# Altium schematic sheet 18_AUDIO_PowerAmp-AnalogT.SchDoc: P30L
size A3; Organization: 六零加智能科技; Address4: www.nidone.com.cn; DocumentNumber: Kang jin; Revision: 1.0; SheetNumber: 16; SheetTotal: 23; Rule: 1.0
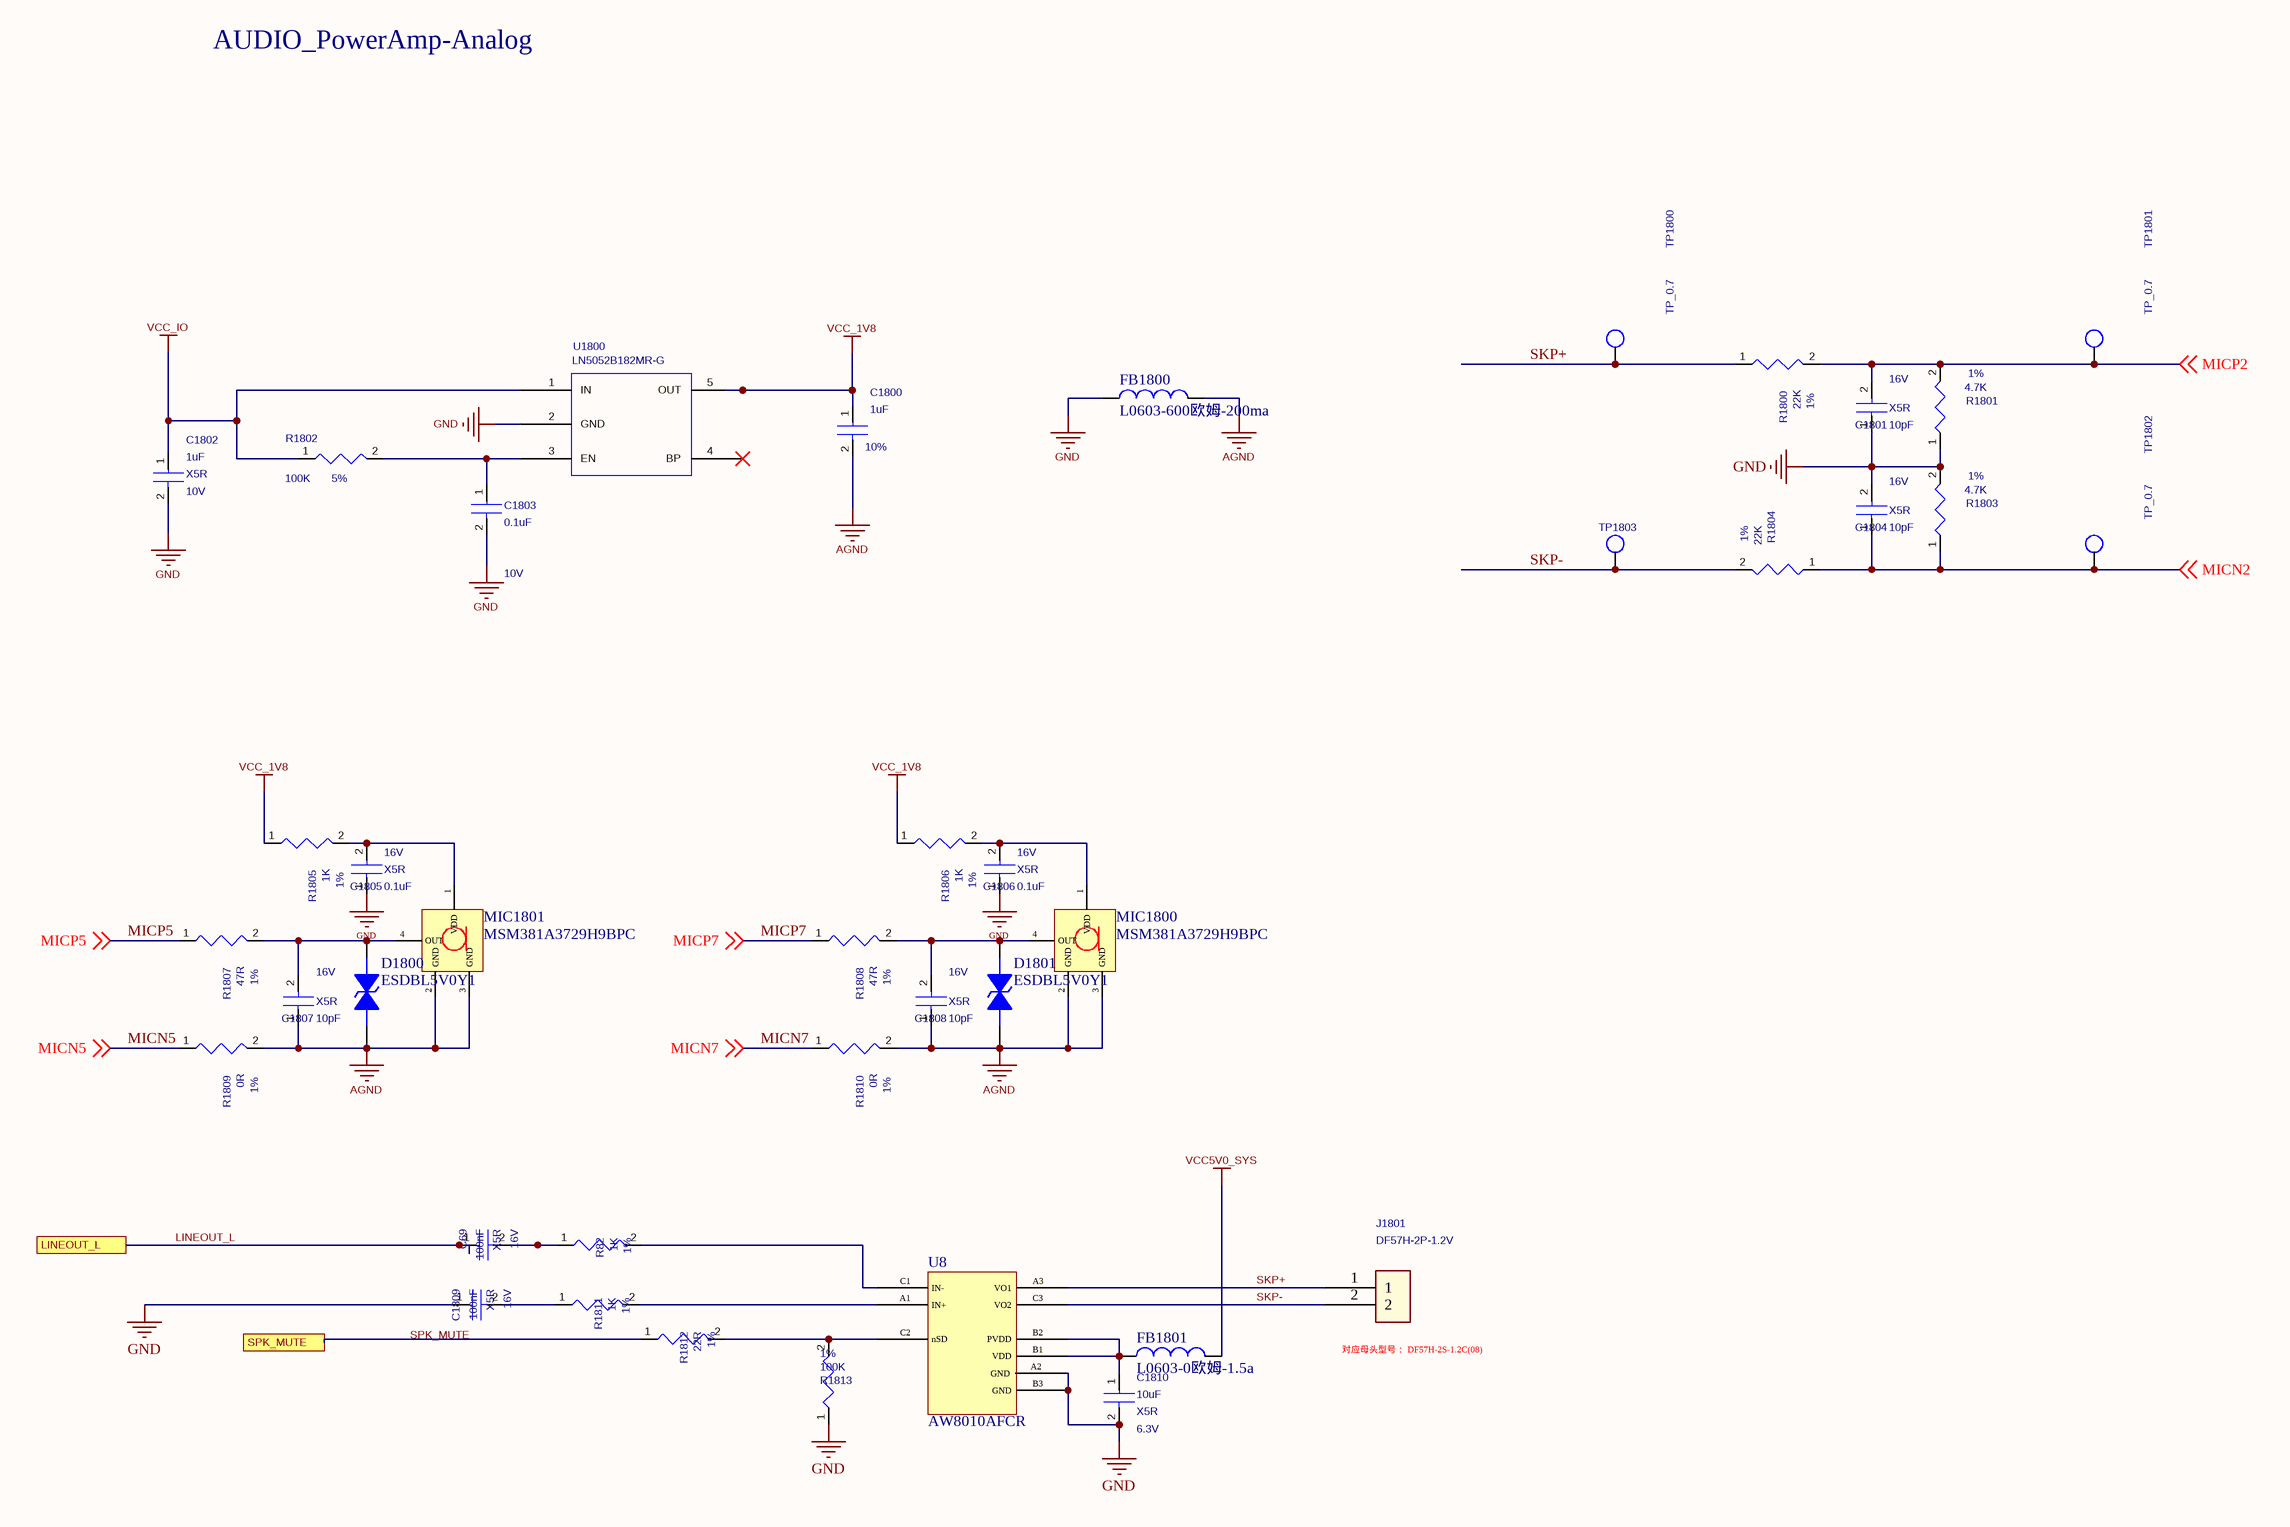
[diagram p0: 18_AUDIO_PowerAmp-AnalogT.SchDoc]

## Parts
C69  value 100nF  Voltage: 16V  Dielectric: X5R  [C0402]  (hidden comment: CAP_NP_2)
C1800  value 1uF  Tolerance: 10%  [C0402]  (hidden comment: CAP_NP_2)
C1801  value 10pF  Voltage: 16V  Dielectric: X5R  [C0402]  (hidden comment: CAP_NP_2)
C1802  value 1uF  Voltage: 10V  Dielectric: X5R  [C0402]  (hidden comment: CAP_NP_2)
C1803  value 0.1uF  Voltage: 10V  [C0402]  (hidden comment: CAP_NP_2)
C1804  value 10pF  Voltage: 16V  Dielectric: X5R  [C0402]  (hidden comment: CAP_NP_2)
C1805  value 0.1uF  Voltage: 16V  Dielectric: X5R  [C0402]  (hidden comment: CAP_NP_2)
C1806  value 0.1uF  Voltage: 16V  Dielectric: X5R  [C0402]  (hidden comment: CAP_NP_2)
C1807  value 10pF  Voltage: 16V  Dielectric: X5R  [C0402]  (hidden comment: CAP_NP_2)
C1808  value 10pF  Voltage: 16V  Dielectric: X5R  [C0402]  (hidden comment: CAP_NP_2)
C1809  value 100nF  Voltage: 16V  Dielectric: X5R  [C0402]  (hidden comment: CAP_NP_2)
C1810  value 10uF  Dielectric: X5R  Voltage: 6.3V  [C0603]  (hidden comment: CAP_NP_2)
D1800  ESDBL5V0Y1  [E0402N]
D1801  ESDBL5V0Y1  [E0402N]
FB1800  L0603-600欧姆-200ma  [L0402]
FB1801  L0603-0欧姆-1.5a  [L0402]
J1801  DF57H-2P-1.2V  [PH插座]
MIC1800  MSM381A3729H9BPC  [MEMS-4pin]
MIC1801  MSM381A3729H9BPC  [MEMS-4pin]
R82  value 1K  Tolerance: 1%  [R0402]  (hidden comment: RESISTOR)
R1800  value 22K  Tolerance: 1%  [R0402]  (hidden comment: RESISTOR)
R1801  value 4.7K  Tolerance: 1%  [R0402]  (hidden comment: RESISTOR)
R1802  value 100K  Tolerance: 5%  [R0402]  (hidden comment: RESISTOR)
R1803  value 4.7K  Tolerance: 1%  [R0402]  (hidden comment: RESISTOR)
R1804  value 22K  Tolerance: 1%  [R0402]  (hidden comment: RESISTOR)
R1805  value 1K  Tolerance: 1%  [R0402]  (hidden comment: RESISTOR)
R1806  value 1K  Tolerance: 1%  [R0402]  (hidden comment: RESISTOR)
R1807  value 47R  Tolerance: 1%  [R0402]  (hidden comment: RESISTOR)
R1808  value 47R  Tolerance: 1%  [R0402]  (hidden comment: RESISTOR)
R1809  value 0R  Tolerance: 1%  [R0402]  (hidden comment: RESISTOR)
R1810  value 0R  Tolerance: 1%  [R0402]  (hidden comment: RESISTOR)
R1811  value 1K  Tolerance: 1%  [R0402]  (hidden comment: RESISTOR)
R1812  value 22R  Tolerance: 1%  [R0402]  (hidden comment: RESISTOR)
R1813  value 100K  Tolerance: 1%  [R0402]  (hidden comment: RESISTOR)
TP1800  TP_0.7  [TEST]
TP1801  TP_0.7  [TEST]
TP1802  TP_0.7  [TEST]
TP1803  TP_0.7  [TEST]  (value not drawn)
U8  AW8010AFCR  [FC-9]
U1800  LN5052B182MR-G  [SOT_23_5]

## Ports
LINEOUT_L, SPK_MUTE

## Nets
AGND: C1800.2 C1807.1 C1808.1 D1800.1 D1801.1 FB1800.2 MIC1800.2(GND) MIC1800.3(GND) MIC1801.2(GND) MIC1801.3(GND) R1809.2 R1810.2
GND: C1801.1 C1802.2 C1803.2 C1804.2 C1805.1 C1806.1 C1809.1 C1810.2 FB1800.1 R1801.1 R1803.2 R1813.1 U8.A2(GND) U8.B3(GND) U1800.2(GND)
VCC5V0_SYS: FB1801.2
VCC_1V8: C1800.1 R1805.1 R1806.1 U1800.5(OUT)
VCC_IO: C1802.1 R1802.1 U1800.1(IN)
LINEOUT_L: C69.1 ; port LINEOUT_L
MICN2: C1804.1 R1803.1 R1804.1 TP1802.1 ; off-sheet MICN2
MICN5: R1809.1 ; off-sheet MICN5
MICN7: R1810.1 ; off-sheet MICN7
MICP2: C1801.2 R1800.2 R1801.2 TP1801.1 ; off-sheet MICP2
MICP5: R1807.1 ; off-sheet MICP5
MICP7: R1808.1 ; off-sheet MICP7
SKP+: J1801.1 R1800.1 TP1800.1 U8.A3(VO1)
SKP-: J1801.2 R1804.2 TP1803.1 U8.C3(VO2)
SPK_MUTE: R1812.1 ; port SPK_MUTE
NetC69_2: C69.2 R82.1
NetC1803_1: C1803.1 R1802.2 U1800.3(EN)
NetC1805_2: C1805.2 MIC1801.1(VDD) R1805.2
NetC1806_2: C1806.2 MIC1800.1(VDD) R1806.2
NetC1807_2: C1807.2 D1800.2 MIC1801.4(OUT) R1807.2
NetC1808_2: C1808.2 D1801.2 MIC1800.4(OUT) R1808.2
NetC1809_2: C1809.2 R1811.1
NetC1810_1: C1810.1 FB1801.1 U8.B1(VDD) U8.B2(PVDD)
NetR82_2: R82.2 U8.C1(IN-)
NetR1811_2: R1811.2 U8.A1(IN+)
NetR1812_2: R1812.2 R1813.2 U8.C2(nSD)

Not connected (* = marked no-connect by the designer): U1800 4(BP)*

## Notes on the sheet
- AUDIO_PowerAmp-Analog
- (near J1801) 对应母头型号： DF57H-2S-1.2C(08)
- Labels drawn without touching a wire or pin: SPK_MUTE
- Title
- Size:
- Date:
- A3
- Engineer:
- Time:
- Revision:
- Sheet
- of
- File:

## Library data of the parts
C69 C1809 = CAP_NP_2: cap,100.00nF,+/-10%,16V,X5R,C0402; Manufacturer_PN: C1005X5R1C104K050BA; Manufacturer: TDK; Created_by: JJJ; Tolerance: 10%; Priority: A; Source_Path: Z:\RK_STANDARD_LIBRARY\CADENCE_CIS\RK_DISCRETE.OLB; Number: 1; PCB DECAL: C0402; Part_Type: C0402; RK_PN: C1005X5R1C104K050BA
C1800 = CAP_NP_2: cap,1.00uF,+/-10%,10V,X5R,C0402; Manufacturer_PN: C1005X5R1A105K050BB; Manufacturer: TDK; Created_by: JJJ; C_Voltage: 6.3V; Priority: A; Source_Path: Z:\RK_STANDARD_LIBRARY\CADENCE_CIS\RK_DISCRETE.OLB; PCB DECAL: C0402; Voltage: 10V; Dielectric: X5R; Part_Type: C0402; RK_PN: C1005X5R1A105K050BB
C1801 C1804 = CAP_NP_2: cap,1nF,+/-10%,16V,X5R,C0402; Manufacturer_PN: C1005X5R1C104K050BA; Manufacturer: TDK; Created_by: JJJ; Tolerance: 10%; Priority: A; Source_Path: Z:\RK_STANDARD_LIBRARY\CADENCE_CIS\RK_DISCRETE.OLB; Number: 1; PCB DECAL: C0402; Part_Type: C0402; RK_PN: C1005X5R1C104K050BA
C1802 = CAP_NP_2: cap,1.00uF,+/-10%,10V,X5R,C0402; Manufacturer: TDK; RK_PN: C1005X5R1A105K050BB; Priority: A; C_Voltage: 6.3V; Tolerance: 10%; Created_by: JJJ; Source_Path: Z:\RK_STANDARD_LIBRARY\CADENCE_CIS\RK_DISCRETE.OLB; PCB DECAL: C0402; Part_Type: C0402; Manufacturer_PN: C1005X5R1A105K050BB
C1803 = CAP_NP_2: cap,0.1uF,+/-10%,10V,X5R,C0402; Manufacturer: TDK; RK_PN: C1005X5R1A105K050BB; Priority: A; C_Voltage: 6.3V; Tolerance: 10%; Created_by: JJJ; Source_Path: Z:\RK_STANDARD_LIBRARY\CADENCE_CIS\RK_DISCRETE.OLB; Part_Type: C0402; Dielectric: X5R; Manufacturer_PN: C1005X5R1A105K050BB; PCB DECAL: C0402
C1805 C1806 = CAP_NP_2: cap,0.1uF,+/-10%,16V,X5R,C0402; Manufacturer_PN: C1005X5R1C104K050BA; Manufacturer: TDK; Created_by: JJJ; Tolerance: 10%; Priority: A; Source_Path: Z:\RK_STANDARD_LIBRARY\CADENCE_CIS\RK_DISCRETE.OLB; Number: 1; PCB DECAL: C0402; Part_Type: C0402; RK_PN: C1005X5R1C104K050BA
C1807 C1808 = CAP_NP_2: cap,10pF,+/-10%,16V,X5R,C0402; Manufacturer_PN: C1005X5R1C104K050BA; Manufacturer: TDK; Created_by: JJJ; Tolerance: 10%; Priority: A; Source_Path: Z:\RK_STANDARD_LIBRARY\CADENCE_CIS\RK_DISCRETE.OLB; Number: 1; PCB DECAL: C0402; Part_Type: C0402; RK_PN: C1005X5R1C104K050BA
C1810 = CAP_NP_2: cap,10.00uF,+/-10%,6.3V,X5R,C0603; Manufacturer: TDK; RK_PN: C1608X5R0J106K080AB; Priority: A; Tolerance: 10%; Created_by: JJJ; Source_Path: Z:\RK_STANDARD_LIBRARY\CADENCE_CIS\RK_DISCRETE.OLB; Number: 1; PCB DECAL: C0603; Part_Type: C0603; Manufacturer_PN: C1608X5R0J106K080AB
D1800 D1801 = TVS
FB1800 FB1801 = INDUCTOR: L0603-0欧姆-1A
J1801 = CON2_1X2: Manufacturer Part Number: CW2001-02G-S03-C; Manufacturer: 褀华电子; Priority: A; Created by: YWQ; Part Type: Header; RK PN: CW2001-02G-S03-C
MIC1800 MIC1801 = MIC
R82 R1805 R1806 R1811 = RESISTOR: ?用厚膜电阻,1K,+/-1%,R0402,1/16W.; Manufacturer_PN: RC0402FR-071KL; Manufacturer: YAGEO; Created_by: YTL; Wattage: 1/16W; Priority: A; Source_Path: Z:\RK_STANDARD_LIBRARY\CADENCE_CIS\RK_DISCRETE.OLB; PCB DECAL: R0402; Part_Type: ?用厚膜电阻; RK_PN: RC0402FR-071KL
R1800 R1804 = RESISTOR: ?用厚膜电阻,22K,+/-1%,R0402,1/16W.; Manufacturer_PN: RC0402FR-071KL; Manufacturer: YAGEO; Created_by: YTL; Wattage: 1/16W; Priority: A; Source_Path: Z:\RK_STANDARD_LIBRARY\CADENCE_CIS\RK_DISCRETE.OLB; PCB DECAL: R0402; Part_Type: ?用厚膜电阻; RK_PN: RC0402FR-071KL
R1801 = RESISTOR: ?用厚膜电阻,4.7K+/-1%,R0402,1/16W.; Manufacturer_PN: RC0402FR-071KL; Manufacturer: YAGEO; Created_by: YTL; Wattage: 1/16W; Priority: A; Source_Path: Z:\RK_STANDARD_LIBRARY\CADENCE_CIS\RK_DISCRETE.OLB; PCB DECAL: R0402; Part_Type: ?用厚膜电阻; RK_PN: RC0402FR-071KL
R1802 = RESISTOR: ?用厚膜电阻,100K,+/-5%,R0402,1/16W.; Manufacturer: YAGEO; RK_PN: RC0402JR-07100KL; Priority: A; Wattage: 1/16W; Created_by: YTL; Source_Path: Z:\RK_STANDARD_LIBRARY\CADENCE_CIS\RK_DISCRETE.OLB; Number: 1; PCB DECAL: R0402; Part_Type: ?用厚膜电阻; Manufacturer_PN: RC0402JR-07100KL
R1803 = RESISTOR: ?用厚膜电阻,4.7K,+/-1%,R0402,1/16W.; Manufacturer_PN: RC0402FR-071KL; Manufacturer: YAGEO; Created_by: YTL; Wattage: 1/16W; Priority: A; Source_Path: Z:\RK_STANDARD_LIBRARY\CADENCE_CIS\RK_DISCRETE.OLB; PCB DECAL: R0402; Part_Type: ?用厚膜电阻; RK_PN: RC0402FR-071KL
R1807 R1808 = RESISTOR: ?用厚膜电阻,47R,+/-1%,R0402,1/16W.; Manufacturer_PN: RC0402FR-071KL; Manufacturer: YAGEO; Created_by: YTL; Wattage: 1/16W; Priority: A; Source_Path: Z:\RK_STANDARD_LIBRARY\CADENCE_CIS\RK_DISCRETE.OLB; PCB DECAL: R0402; Part_Type: ?用厚膜电阻; RK_PN: RC0402FR-071KL
R1809 R1810 = RESISTOR: ?用厚膜电阻,0R,+/-1%,R0402,1/16W.; Manufacturer_PN: RC0402FR-071KL; Manufacturer: YAGEO; Created_by: YTL; Wattage: 1/16W; Priority: A; Source_Path: Z:\RK_STANDARD_LIBRARY\CADENCE_CIS\RK_DISCRETE.OLB; PCB DECAL: R0402; Part_Type: ?用厚膜电阻; RK_PN: RC0402FR-071KL
R1812 = RESISTOR: ?用厚膜电阻,22R,+/-1%,R0402,1/16W.; Manufacturer_PN: RC0402FR-071KL; Manufacturer: YAGEO; Created_by: YTL; Wattage: 1/16W; Priority: A; Source_Path: Z:\RK_STANDARD_LIBRARY\CADENCE_CIS\RK_DISCRETE.OLB; PCB DECAL: R0402; Part_Type: ?用厚膜电阻; RK_PN: RC0402FR-071KL
R1813 = RESISTOR: ?用厚膜电阻,100K,+/-1%,R0402,1/16W.; Manufacturer_PN: RC0402FR-071KL; Manufacturer: YAGEO; Created_by: YTL; Wattage: 1/16W; Priority: A; Source_Path: Z:\RK_STANDARD_LIBRARY\CADENCE_CIS\RK_DISCRETE.OLB; PCB DECAL: R0402; Part_Type: ?用厚膜电阻; RK_PN: RC0402FR-071KL
TP1800-TP1803 = TP: Test Point 0.7mm; RK PN: TESTPOINT_0R7; Priority: A; Part Type: TP; Created by: JJJ
U8 = U
U1800 = LDO_PT5108: High-PSRR 600mA LDO.Output1.8V.; Part_Type: LDO; Manufacturer: Powtech(华润矽威）; RK_PN: ME6212C18M5G; Priority: A; Created_by: JJJ; Source_Path: Z:\RK_STANDARD_LIBRARY\CADENCE_CIS\RK_IC.OLB; Number: 1; PCB DECAL: SOT_23_5; Manufacturer_PN: LN5052B182MR-G; Value: LN5052B182MR-G